# EAGLE design shield (EAGLE 9.1.1)
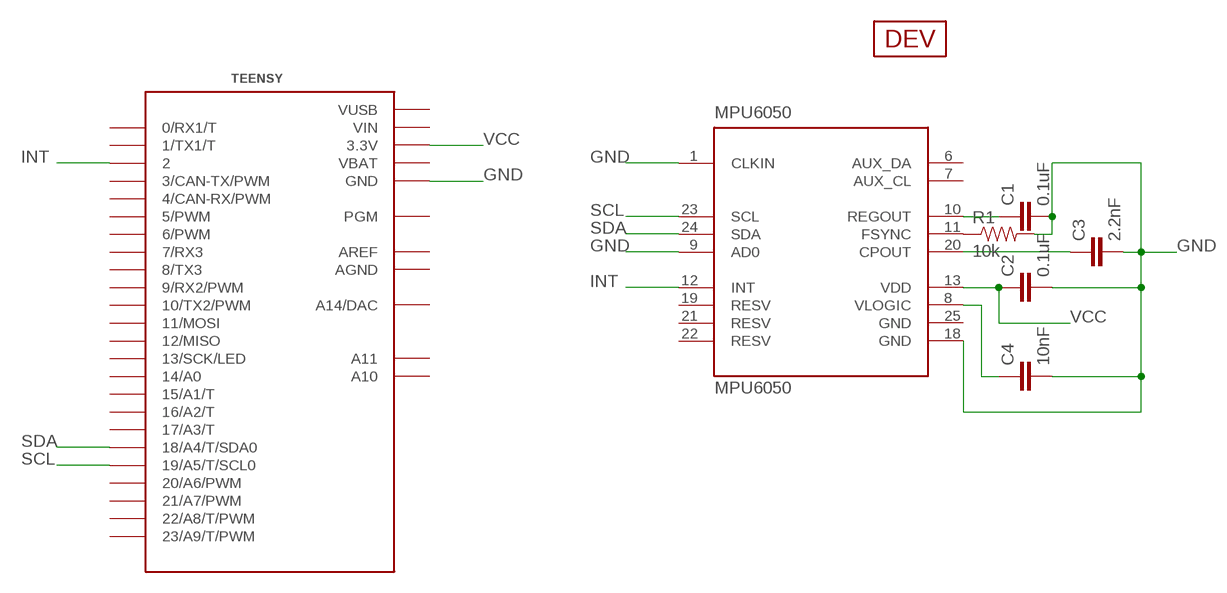
[diagram p0: schematic, sheet 1]

## Parts
C1  0.1uF  CAP0603-CAP  [0603-CAP]
C2  0.1uF  CAP0603-CAP  [0603-CAP]
C3  2.2nF  CAP0603-CAP  [0603-CAP]
C4  10nF  CAP0603-CAP  [0603-CAP]
MPU6050  MPU6050  [QFN50P400X400X95-25T265X275N]
R1  10k  RESISTOR0603-RES  [0603-RES]
TEENSY  TEENSY_3.1-3.2_ALL_PINS  [TEENSY_3.0-3.2&LC_ALL_PINS]
U$1  DEV  [DEV]

## Nets
GND: C1.2 C2.2 C3.2 C4.2 MPU6050.1(CLKIN) MPU6050.9(AD0) MPU6050.18(GND) R1.2 TEENSY.GND TEENSY.GND1(GND)
INT: MPU6050.12(INT) TEENSY.2
N$1: C3.1 MPU6050.20(CPOUT)
N$2: C1.1 MPU6050.10(REGOUT)
N$3: C4.1 MPU6050.8(VLOGIC)
N$4: MPU6050.11(FSYNC) R1.1
SCL: MPU6050.23(SCL) TEENSY.19/A5(19/A5/T/SCL0)
SDA: MPU6050.24(SDA) TEENSY.18/A4(18/A4/T/SDA0)
VCC: C2.1 MPU6050.13(VDD) TEENSY.3.3V TEENSY.3.3V1(3.3V)
Unconnected: MPU6050.2(NC) MPU6050.3(NC) MPU6050.4(NC) MPU6050.5(NC) MPU6050.6(AUX_DA) MPU6050.7(AUX_CL) MPU6050.14(NC) MPU6050.15(NC) MPU6050.16(NC) MPU6050.17(NC) MPU6050.19(RESV) MPU6050.21(RESV) MPU6050.22(RESV) TEENSY.0(0/RX1/T) TEENSY.1(1/TX1/T) TEENSY.3(3/CAN-TX/PWM) TEENSY.4(4/CAN-RX/PWM) TEENSY.5(5/PWM) TEENSY.6(6/PWM) TEENSY.7(7/RX3) TEENSY.8(8/TX3) TEENSY.9(9/RX2/PWM) TEENSY.10(10/TX2/PWM) TEENSY.11(11/MOSI) TEENSY.12(12/MISO) TEENSY.13(13/SCK/LED) TEENSY.14/A0 TEENSY.15/A1(15/A1/T) TEENSY.16/A2(16/A2/T) TEENSY.17/A3(17/A3/T) TEENSY.20/A6(20/A6/PWM) TEENSY.21/A7(21/A7/PWM) TEENSY.22/A8(22/A8/T/PWM) TEENSY.23/A9(23/A9/T/PWM) TEENSY.A10 TEENSY.A11 TEENSY.PGM TEENSY.RESET/DAC(A14/DAC)

## Power pins joined to a net without a drawn wire
AGND: TEENSY.AGND
AREF: TEENSY.AREF
GND: MPU6050.25(GND)
VBAT: TEENSY.VBAT
VIN: TEENSY.VIN
VUSB: TEENSY.VUSB

## Library data of the parts
C1-C4 = SparkFun-Passives:CAP: Capacitor Standard 0603 ceramic capacitor, and 0.1" leaded capacitor.
MPU6050 = invensense:MPU6050: The triple-axis MEMS gyroscope
R1 = SparkFun-Passives:RESISTOR: Resistor Basic schematic elements and footprints for 0603, 1206, and PTH resistors.
TEENSY = Teensy:TEENSY_3.1-3.2_ALL_PINS: Footprint for Teensy 3.1 or 3.2 board using all through-holes, i.e. the entire perimeter plus the 4 through-holes inboard (A10,A11,AREF, VUSB)
U$1 = Custom_old (1):DEV

## Board
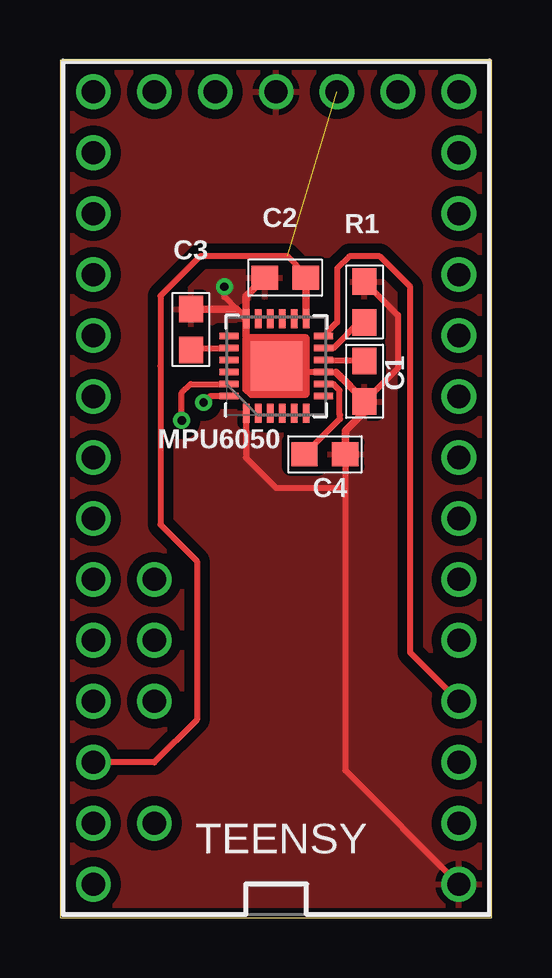
[diagram p1: board, top side]
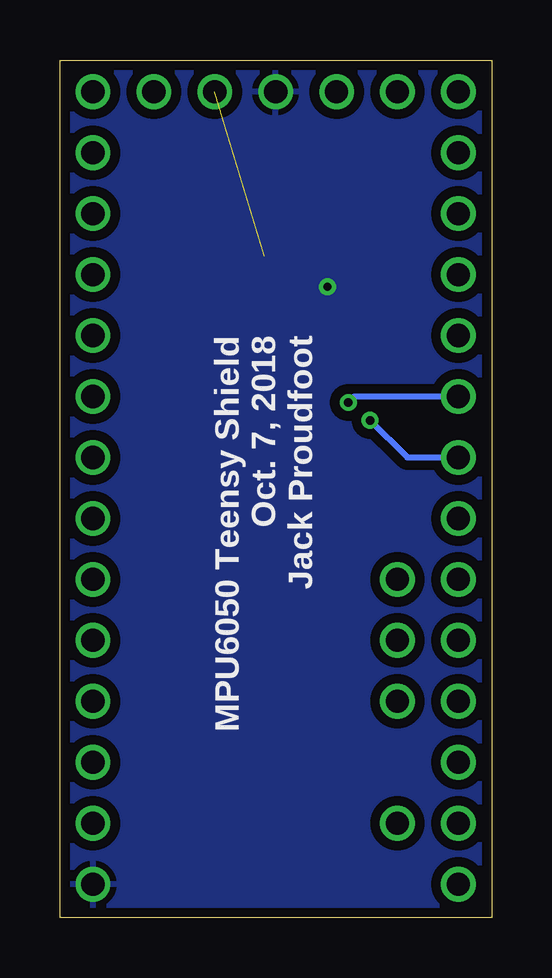
[diagram p2: board, bottom side, seen from below]

Size 18.01 x 35.74 mm. Coordinates in mm from the lower left corner, seen from the top.
Outline: 0,0 18.01,0 18.01,35.74 0,35.74 0,0
Copper layers (1*16): Top 0.0356mm / dielectric 1.5011mm / Bottom 0.0356mm
Design rules "gerry-jlcpcb": minimum track width 5mil, minimum drill 13mil, track to track 5mil, track to pad 5mil, pad to pad 5mil, via to via 5mil, smd to smd 5mil, copper to edge 15mil, drill to drill 6mil, minimum pad ring 7mil, minimum via ring 7mil, stop-mask expansion 2.5mil, vias tented up to drill 14mm, thermal gap 10mil

### Footprints (pad centres in the part's own frame; a part is rotated, then mirrored left to right if it is on the bottom)
0603-CAP = smd 1.1 x 1: 1 -0.85,0; 2 0.85,0
QFN50P400X400X95-25T265X275N = smd 0.26 x 0.79: 1 -1.25,-1.97; 2 -0.75,-1.97; 3 -0.25,-1.97; 4 0.25,-1.97; 5 0.75,-1.97; 6 1.25,-1.97; 13 1.25,1.97; 14 0.75,1.97; 15 0.25,1.97; 16 -0.25,1.97; 17 -0.75,1.97; 18 -1.25,1.97 | smd 0.79 x 0.26: 7 1.97,-1.25; 8 1.97,-0.75; 9 1.97,-0.25; 10 1.97,0.25; 11 1.97,0.75; 12 1.97,1.25; 19 -1.97,1.25; 20 -1.97,0.75; 21 -1.97,0.25; 22 -1.97,-0.25; 23 -1.97,-0.75; 24 -1.97,-1.25 | smd 2.15 x 2.05: 25 0,0
0603-RES = smd 1.1 x 1: 1 -0.85,0; 2 0.85,0
TEENSY_3.0-3.2&LC_ALL_PINS = drill 0.965: 0 -7.62,13.97; 1 -7.62,11.43; 2 -7.62,8.89; 3 -7.62,6.35; 3.3V 7.62,11.43; 3.3V1 -2.54,-16.51; 4 -7.62,3.81; 5 -7.62,1.27; 6 -7.62,-1.27; 7 -7.62,-3.81; 8 -7.62,-6.35; 9 -7.62,-8.89; 10 -7.62,-11.43; 11 -7.62,-13.97; 12 -7.62,-16.51; 13 7.62,-16.51; 14/A0 7.62,-13.97; 15/A1 7.62,-11.43; 16/A2 7.62,-8.89; 17/A3 7.62,-6.35; 18/A4 7.62,-3.81; 19/A5 7.62,-1.27; 20/A6 7.62,1.27; 21/A7 7.62,3.81; 22/A8 7.62,6.35; 23/A9 7.62,8.89; A10 5.08,6.35; A11 5.08,3.81; AGND 7.62,13.97; AREF 5.08,8.89; GND -7.62,16.51; GND1 0,-16.51; PGM 2.54,-16.51; RESET/DAC 5.08,-16.51; VBAT -5.08,-16.51; VIN 7.62,16.51; VUSB 5.08,13.97

### Placement (x,y rotation side)
C1  12.7,22.35 270 top
C2  9.4,26.67 180 top
C3  5.46,24.51 90 top
C4  11.05,19.3 0 top
MPU6050  9.02,22.99 0 top
R1  12.7,25.65 90 top
TEENSY  9.02,17.91 180 top
U$1  11.56,5.21 90 top

### Tracks (layer width: path | path; a pad name or v marks a point on that pad's centre or on a via)
GND  (via drill 0.35)
  Top 0.254: 11.52,22.74 MPU6050.9 9.27,22.74 MPU6050.25 | C4.2 11.9,17.91 | 11.9,17.91 11.9,6.13 TEENSY.GND | MPU6050.1 7.77,19.2 7.75,19.18 9.02,17.91 11.9,17.91 | 7.36,25.36 6.86,25.87 v6.86,26.29 | R1.2 14.1,25.11 14.1,22.9 12.73,21.53
  Top 0.305: MPU6050.18 7.77,24.24 MPU6050.25 | MPU6050.18 7.36,25.36 6.48,25.36 C3.2 | MPU6050.18 7.77,25.89 C2.2 | C4.2 11.9,20.28 12.7,21.08 C1.2 12.73,21.53 12.1,22.15 12.1,22.16 11.52,22.74
  pour Top (isolate 0.406): -1.14,36.96 19.18,36.96 19.18,-1.14 -1.14,-1.14
  pour Bottom (isolate 0.406): -1.14,36.96 19.18,36.96 19.18,-1.14 -1.14,-1.14
INT
  Top 0.254: MPU6050.12 11.28,24.53 11.56,24.81 11.56,27.05 12.07,27.56 13.34,27.56 14.61,26.29 14.61,11.05 TEENSY.2
N$1
  Top 0.254: C3.1 5.54,23.74 MPU6050.20
N$2
  Top 0.254: MPU6050.10 12.67,23.24 C1.1
N$3
  Top 0.254: C4.1 11.68,20.79 11.68,20.95 11.67,20.96 11.67,21.98 11.41,22.24 MPU6050.8
N$4
  Top 0.254: R1.1 12.47,24.8 11.41,23.74 MPU6050.11
SCL  (via drill 0.35)
  Top 0.254: v5.08,20.72 5.08,21.87 5.45,22.24 MPU6050.23
  Bottom 0.254: v5.08,20.72 3.53,19.18 TEENSY.19/A5
SDA  (via drill 0.35)
  Top 0.254: MPU6050.24 6.26,21.74 v5.99,21.47
  Bottom 0.254: v5.99,21.47 5.74,21.72 TEENSY.18/A4
VCC  (1 unrouted)
  Top 0.254: TEENSY.3.3V 3.94,6.48 5.71,8.26 5.71,14.86 4.19,16.38 4.19,22.99 4.19,25.91 5.84,27.56 9.49,27.56 10.25,26.8 C2.1
  Top 0.305: MPU6050.13 10.27,26.65 C2.1

### Text on the board
bPlace: MPU6050 Teensy Shield / Oct. 7, 2018 / Jack Proudfoot